# Altium schematic sheet esp32_gyro.SchDoc
size 431 x 279 mm; SheetNumber: 1; SheetTotal: 1; SPICEModelCacheXUEKYTOL: <root> / <DocumentId>XUEKYTOL</DocumentId> / </root>
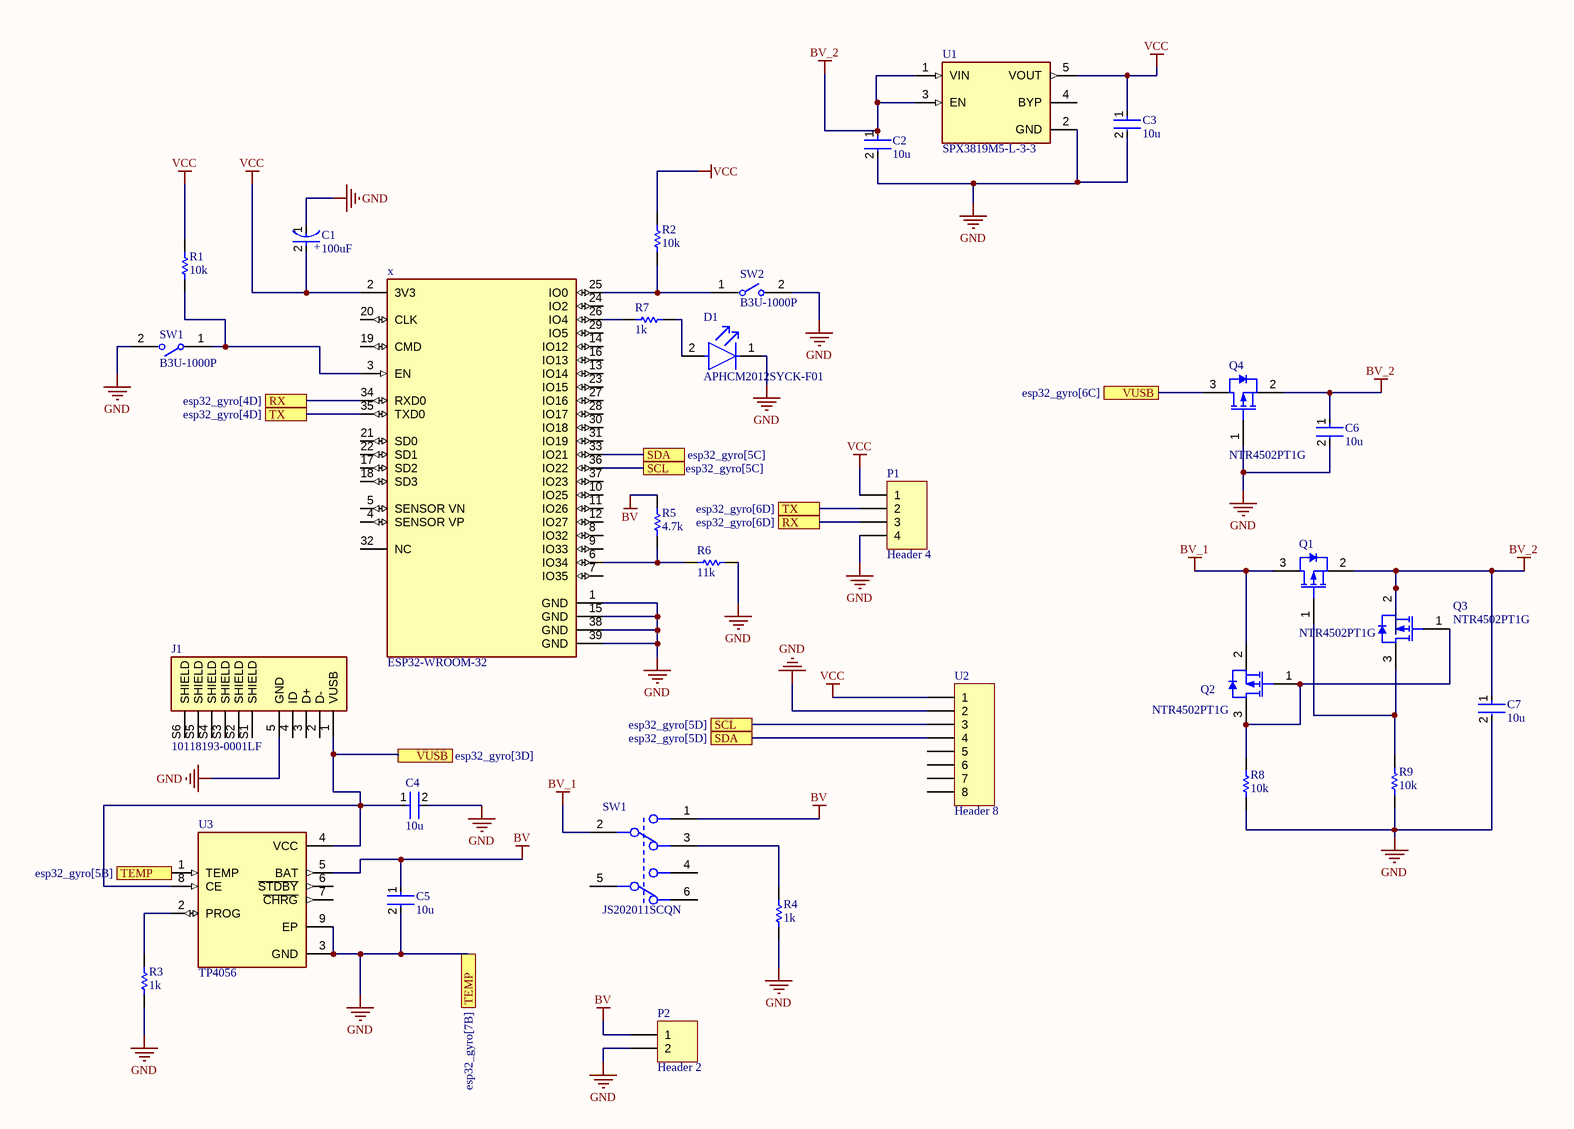
[diagram p0: esp32_gyro.SchDoc]

## Parts
(Parts that share a designator on the sheet are numbered #1, #2 ... from top to bottom, then left to right.)
C1  100uF  [FP-TAJB-MFG]
C2  10u  [FP-0805-L_2_01_0_2-W_1_25-IPC_B]
C3  10u  [FP-0805-L_2_01_0_2-W_1_25-IPC_B]
C4  10u  [FP-0805-L_2_01_0_2-W_1_25-IPC_B]
C5  10u  [FP-0805-L_2_01_0_2-W_1_25-IPC_B]
C6  10u  [FP-0805-L_2_01_0_2-W_1_25-IPC_B]
C7  10u  [FP-0805-L_2_01_0_2-W_1_25-IPC_B]
D1  APHCM2012SYCK-F01  [FP-APHCM2012SYCK-F01-MFG]
J1  10118193-0001LF  [FCI_10118193-0001LF]
P1  Header 4  [HDR1X4]
P2  Header 2  [HDR1X2]
Q1  NTR4502PT1G  [ONSC-SOT-23-3-318-08_V]
Q2  NTR4502PT1G  [ONSC-SOT-23-3-318-08_V]
Q3  NTR4502PT1G  [ONSC-SOT-23-3-318-08_V]
Q4  NTR4502PT1G  [ONSC-SOT-23-3-318-08_V]
R1  10k  [RESC2013X50X30LL20T20]
R2  10k  [RESC2013X50X30LL20T20]
R3  1k  [RESC2013X50X30LL20T20]
R4  1k  [RESC2013X50X30LL20T20]
R5  4.7k  [RESC2013X50X30LL20T20]
R6  11k  [RESC2013X50X30LL20T20]
R7  1k  [RESC2013X50X30LL20T20]
R8  10k  [RESC2013X50X30LL20T20]
R9  10k  [RESC2013X50X30LL20T20]
SW1#1  B3U-1000P  [FP-B3U-1000P-MFG]
SW1#2  JS202011SCQN  [FP-JS202011SCQN-MFG]
SW2  B3U-1000P  [FP-B3U-1000P-MFG]
U1  SPX3819M5-L-3-3  [SOT95P280X145-5N]
U2  Header 8  [HDR1X8]
U3  TP4056  [SOP127P600X175-9N]
x  ESP32-WROOM-32  [FP-ESP32-WROOM-32-MFG]

## Ports
RX (see esp32_gyro[4D]), RX (see esp32_gyro[6D]), SCL (see esp32_gyro[5C]), SCL (see esp32_gyro[5D]), SDA (see esp32_gyro[5C]), SDA (see esp32_gyro[5D]), TEMP (see esp32_gyro[5B]), TEMP (see esp32_gyro[7B]), TX (see esp32_gyro[4D]), TX (see esp32_gyro[6D]), VUSB (see esp32_gyro[3D]), VUSB (see esp32_gyro[6C])

## Nets
BV: C5.1 P2.1 R5.1 SW1#2.1 U3.5(BAT)
BV_1: Q1.3(D) Q2.2(S) SW1#2.2
BV_2: C2.1 C6.1 C7.1 Q1.2(S) Q3.2(S) Q4.2(S) U1.1(VIN) U1.3(EN)
GND: C1.1(C) C2.2 C3.2 C4.2 C5.2 C6.2 C7.2 D1.1(C) J1.5(GND) P1.4 P2.2 Q4.1(G) R3.1 R4.1 R6.1 R8.1 R9.1 SW1#1.2 SW2.2 U1.2(GND) U2.2 U3.1(TEMP) U3.3(GND) U3.9(EP) x.1(GND) x.15(GND) x.38(GND) x.39(GND) ; port TEMP
VCC: C1.2(A) C3.1 P1.1 R1.2 R2.2 U1.5(VOUT) U2.1 x.2(3V3)
RX: P1.3 x.34(RXD0) ; port RX
SCL: U2.3 x.36(IO22) ; port SCL
SDA: U2.4 x.33(IO21) ; port SDA
TX: P1.2 x.35(TXD0) ; port TX
VUSB: C4.1 J1.1(VUSB) Q4.3(D) U3.4(VCC) U3.8(CE) ; port VUSB
NetD1_2: D1.2(A) R7.2
NetQ1_1: Q1.1(G) Q3.3(D) R9.2
NetQ2_1: Q2.1(G) Q2.3(D) Q3.1(G) R8.2
NetR1_1: R1.1 SW1#1.1 x.3(EN)
NetR2_1: R2.1 SW2.1 x.25(IO0)
NetR3_2: R3.2 U3.2(PROG)
NetR4_2: R4.2 SW1#2.3
NetR5_2: R5.2 R6.2 x.6(IO34)
NetR7_1: R7.1 x.26(IO4)

Not connected (* = marked no-connect by the designer): J1 2(D-) 3(D+) 4(ID) S1(SHIELD) S2(SHIELD) S3(SHIELD) S4(SHIELD) S5(SHIELD) S6(SHIELD); SW1#2 4 5 6; U1 4(BYP); U2 5 6 7 8; U3 6(~{STDBY}) 7(~{CHRG}); x 4(SENSOR_VP) 5(SENSOR_VN) 7(IO35) 8(IO32) 9(IO33) 10(IO25) 11(IO26) 12(IO27) 13(IO14) 14(IO12) 16(IO13) 17(SD2) 18(SD3) 19(CMD) 20(CLK) 21(SD0) 22(SD1) 23(IO15) 24(IO2) 27(IO16) 28(IO17) 29(IO5) 30(IO18) 31(IO19) 32(NC) 37(IO23)

## Notes on the sheet
- DWG. NO.
- REV.
- SHT.
- THIS DOCUMENT AND THE DATA DISCLOSED HEREIN OR HEREWITH IS THE PROPERTY OF ALTIUM LIMITED AND MAY BE FREELY DISTRIBUTED IN WHOLE. NO RIGHTS ARE RESERVED OR EXPRESS OR IMPLIED WARANTEE GIVEN.
- REVISION
- DESCRIPTION
- DATE
- APPROVED
- ENG:
- APPROVALS
- PROJECT
- DSN:
- CHK:
- REFERENCE DOCUMENTS
- PROJECT REVISION:
- TITLE
- DOCUMENT REVISION:
- DESIGN ITEM:
- BOM:
- FAB DWG:
- PCB DWG:
- ASSY DWG:
- SCALE:
- SIZE
- B
- CAGE CODE
- FILE NAME
- DWG NO.
- SHEET
- OF
- REV
- (in symbol CMP-04424-000592-1) +

## Library data of the parts
C1 = CMP-04424-000592-1: 100uF 6.3V  ±20% 1.7Ω 1210  SMD Tantalum Capacitor; ESR (Equivalent Series Resistance): 1.7R; Leakage Current: 6.3uA; Polarity: Polar; Dissipation Factor: 10%; Termination: SMD/SMT; Max Operating Temperature: 125°C; RoHS Compliant: Yes; Capacitance: 100uF; Features: General Purpose; Voltage Rating (DC): 6.3V; Width: 2.8mm; Construction: Flat; Length: 3.5mm; Height: 2.1mm; Min Operating Temperature: -55°C; Tolerance: 20%; Lead Free: Lead Free; Mount: Surface Mount; Voltage Rating: 6.3V; Package Quantity: 1; Packaging: Tape and Reel; Case/Package: 1210; Case Code (Imperial): 1210; Depth: 2.8mm; Case Code (Metric): 3528; Series: TAJ; Number of Pins: 2; REACH SVHC: No SVHC; Radiation Hardening: No; Height - Seated (Max): 0.083inch
C2-C7 = CMP-2000-05016-2: General Purpose Ceramic Capacitor, 0805, 100nF, 10%, X7R, 0.15, 50V; Dissipation Factor: 2.5%; Insulation Resistance: 100GR; Voltage Rating (DC): 50V; Package Quantity: 4000; Tolerance: 10%; Voltage Rating: 50V; Dielectric: X7R; Case/Package: 0805; Lead Free: Lead Free; Dielectric Material: Ceramic; Thickness: 0.037inch; Weight: 0.001411oz; Max Operating Temperature: 125°C; REACH SVHC: No SVHC; Mount: Surface Mount; RoHS Compliant: Yes; Depth: 1.25mm; Height: 0.5mm; Case Code (Metric): 2012; Length: 2mm; Termination: Standard; Case Code (Imperial): 0805; Number of Pins: 2; Voltage: 50V; Radiation Hardening: No; Min Operating Temperature: -55°C; Capacitance: 100nF; Width: 1.2mm; Series: MLCC X7R; Packaging: Cut Tape
D1 = CMP-44529-000064-1: LED YELLOW CLEAR CHIP SMD; Number of LEDs: 1; Luminous Intensity: 150mcd; Dominant Wavelength: 590nm; Test Current: 20mA; Illumination Color: Green; Forward Voltage: 2V; Viewing Angle: 110°; Number of Pins: 2; Packaging: Tape and Reel; Width: 1.25mm; Height: 0.4mm; Lens Color: Clear; RoHS Compliant: Yes; Lead Free: Lead Free; Min Operating Temperature: -40°C; Case Code (Imperial): 0805; Case/Package: 0805; Series: APHCM; Wavelength: 590nm; Max Operating Temperature: 85°C; Length: 2mm; Color: Yellow; Package Quantity: 2000; Mount: Surface Mount; Lens Style: Clear; Forward Current: 20mA; Case Code (Metric): 2012
J1 = 10118193-0001LF: USB - micro B USB 2.0 Receptacle Connector 5 Position Surface Mount, Right Angle; Through Hole; MF: FCI; SnapEDA_Link: https://www.snapeda.com/parts/10118193-0001LF/Amphenol+FCI/view-part/?ref=snap; Package: None; MP: 10118193-0001LF; Check_prices: https://www.snapeda.com/parts/10118193-0001LF/Amphenol+FCI/view-part/?ref=eda; Purchase-URL: https://pricing.snapeda.com/search/part/10118193-0001LF/?ref=eda; Price: None; Value: *; Availability: In Stock
P1 = Header 4: Header, 4-Pin; LatestRevisionDate: 17-Jul-2002; LatestRevisionNote: Re-released for DXP Platform.; Publisher: Altium Limited
P2 = Header 2: Header, 2-Pin; LatestRevisionDate: 17-Jul-2002; LatestRevisionNote: Re-released for DXP Platform.; Publisher: Altium Limited
Q1-Q4 = CMP-1058-00734-1: Power MOSFET, -30 V, -1.95 A, Single, P-Channel, 3-Pin SOT-23, Pb-Free, Tape and Reel; Manufacturer: On Semiconductor; VGS(th) Max (V): 3; Crss Typ (pF): 50; ID Max (A): 1.95; Ciss Typ (pF): 200; Coss Typ (pF): 80; Channel Polarity: P Channel; V(BR)DSS Min (V): 30; VGS Max (V): 20; PackageReference: SOT-23-3-318-08; Mounting Technology: Surface Mount; RoHS: Pb-Free; PartNumber: NTR4502PT1G; DatasheetVersion: Rev. 5; ComponentLink3URL: http://www.onsemi.cn/pub_link/Collateral/318-08.PDF; PackageDescription: 3-Pin Small Outline Transistor, Body 2.92 x 1.3 mm, Pitch 0.95 mm; ComponentLink1Description: Manufacturer URL; ComponentLink3Description: Package Specification; ComponentLink2Description: Datasheet; ComponentLink1URL: http://www.onsemi.com/; ComponentLink2URL: http://www.onsemi.cn/pub_link/Collateral/NTR4502P-D.PDF; Configuration: Single; PackageVersion: Rev. AP, 11/2009; Packing: Tape and Reel; Package Type: SOT-23-3
R1-R9 = CMP-2001-04896-1: Manufacturer: Vishay Dale; Part Number: CRCW08050000Z0EA
SW1#1 SW2 = CMP-2100-03586-2: SWITCH TACTILE SPST-NO 0.05A 12V; Contact Resistance: 100mR; Operating Force: 1.5N; Max Current Rating: 50mA; Switch Travel: 0.15mm; Actuator Type: Standard; Mechanical Life: 200000Cycles; Ratings: Dust Proof; Illumination Type: Non-Illuminated; Throw Configuration: SPST; Actuator Length: 0.4mm; Switch Function: Off-Mom; Height: 1.2mm; Width: 3mm; Weight: 0.000776oz; Contact Material: Silver; Max Voltage Rating (DC): 12V; Insulation Resistance: 100MR; Lead Free: Lead Free; Current Rating: 50mA; Termination: SMD/SMT; Length: 4mm; Voltage Rating (DC): 12V; Contact Current Rating: 50mA; Orientation: Straight; Depth: 2.5mm; Max Operating Temperature: 70°C; Packaging: Tape and Reel; Min Operating Temperature: -25°C; Package Quantity: 1; Mount: Surface Mount; Electrical Life: 200000Cycles
SW1#2 = CMP-2000-05087-3: SWITCH SLIDE DPDT 300MA 6V; Switch Function: On-On; Actuator Type: Standard; Switch Travel: 2mm; Actuator Color: Black; Contact Resistance: 70mR; Electrical Life: 5000Cycles; Actuator Material: Nylon; REACH SVHC: No SVHC; Series: JS; Min Operating Temperature: -20°C; Depth: 7.5mm; Housing Material: Nylon; Voltage Rating (DC): 6V; Max Operating Temperature: 85°C; Contact Current Rating: 300mA; Package Quantity: 1; Contact Plating: Silver; Contact Material: Copper Alloy; Throw Configuration: DPDT; Current Rating: 300mA; Orientation: Vertical; Max Current Rating: 300mA; Max Voltage Rating (DC): 6V; Flammability Rating: UL94 V-2; Length: 9mm; Packaging: Tape and Reel; Mount: Surface Mount; Actuator Length: 2mm; Lead Free: Lead Free; Termination: Gull Wing; Radiation Hardening: No
U1 = SPX3819M5-L-3-3: Linear Voltage Regulator IC Positive Fixed 1 Output 500mA SOT-23-5; MP: SPX3819M5-L-3-3/TR; MF: MaxLinear, Inc.; Price: None; Purchase-URL: https://pricing.snapeda.com/search/part/SPX3819M5-L-3-3/TR/?ref=eda; Check_prices: https://www.snapeda.com/parts/SPX3819M5-L-3-3/TR/MaxLinear%252C+Inc./view-part/?ref=eda; SnapEDA_Link: https://www.snapeda.com/parts/SPX3819M5-L-3-3/TR/MaxLinear%252C+Inc./view-part/?ref=snap; Availability: In Stock; Package: SOT-23-5 Exar; Value: *
U2 = Header 8: Header, 8-Pin; LatestRevisionDate: 17-Jul-2002; LatestRevisionNote: Re-released for DXP Platform.; Publisher: Altium Limited
U3 = TP4056: Complete single cell Li-Ion battery with a constant current / constant voltage linear charger; MF: NanJing Top Power ASIC Corp.; Availability: Not in stock; SnapEDA_Link: https://www.snapeda.com/parts/TP4056/NanJing+Top+Power+ASIC+Corp./view-part/?ref=snap; Check_prices: https://www.snapeda.com/parts/TP4056/NanJing+Top+Power+ASIC+Corp./view-part/?ref=eda; Price: None; Package: Package; MP: TP4056; Value: *
x = CMP-194065-000008-1: RX TXRX MOD WIFI SURFACE MOUNT; Frequency: 2.5GHz; Sensitivity: -98dBm; Operating Supply Voltage: 3.6V; Data Rate: 150Mbps; Weight: 0.088185oz; Package Quantity: 550; Min Operating Temperature: -40°C; Mount: Surface Mount; Max Operating Temperature: 85°C; Packaging: Cut Tape; Case/Package: SMD/SMT